# EAGLE design Optical Encoder (EAGLE 7.1.0)
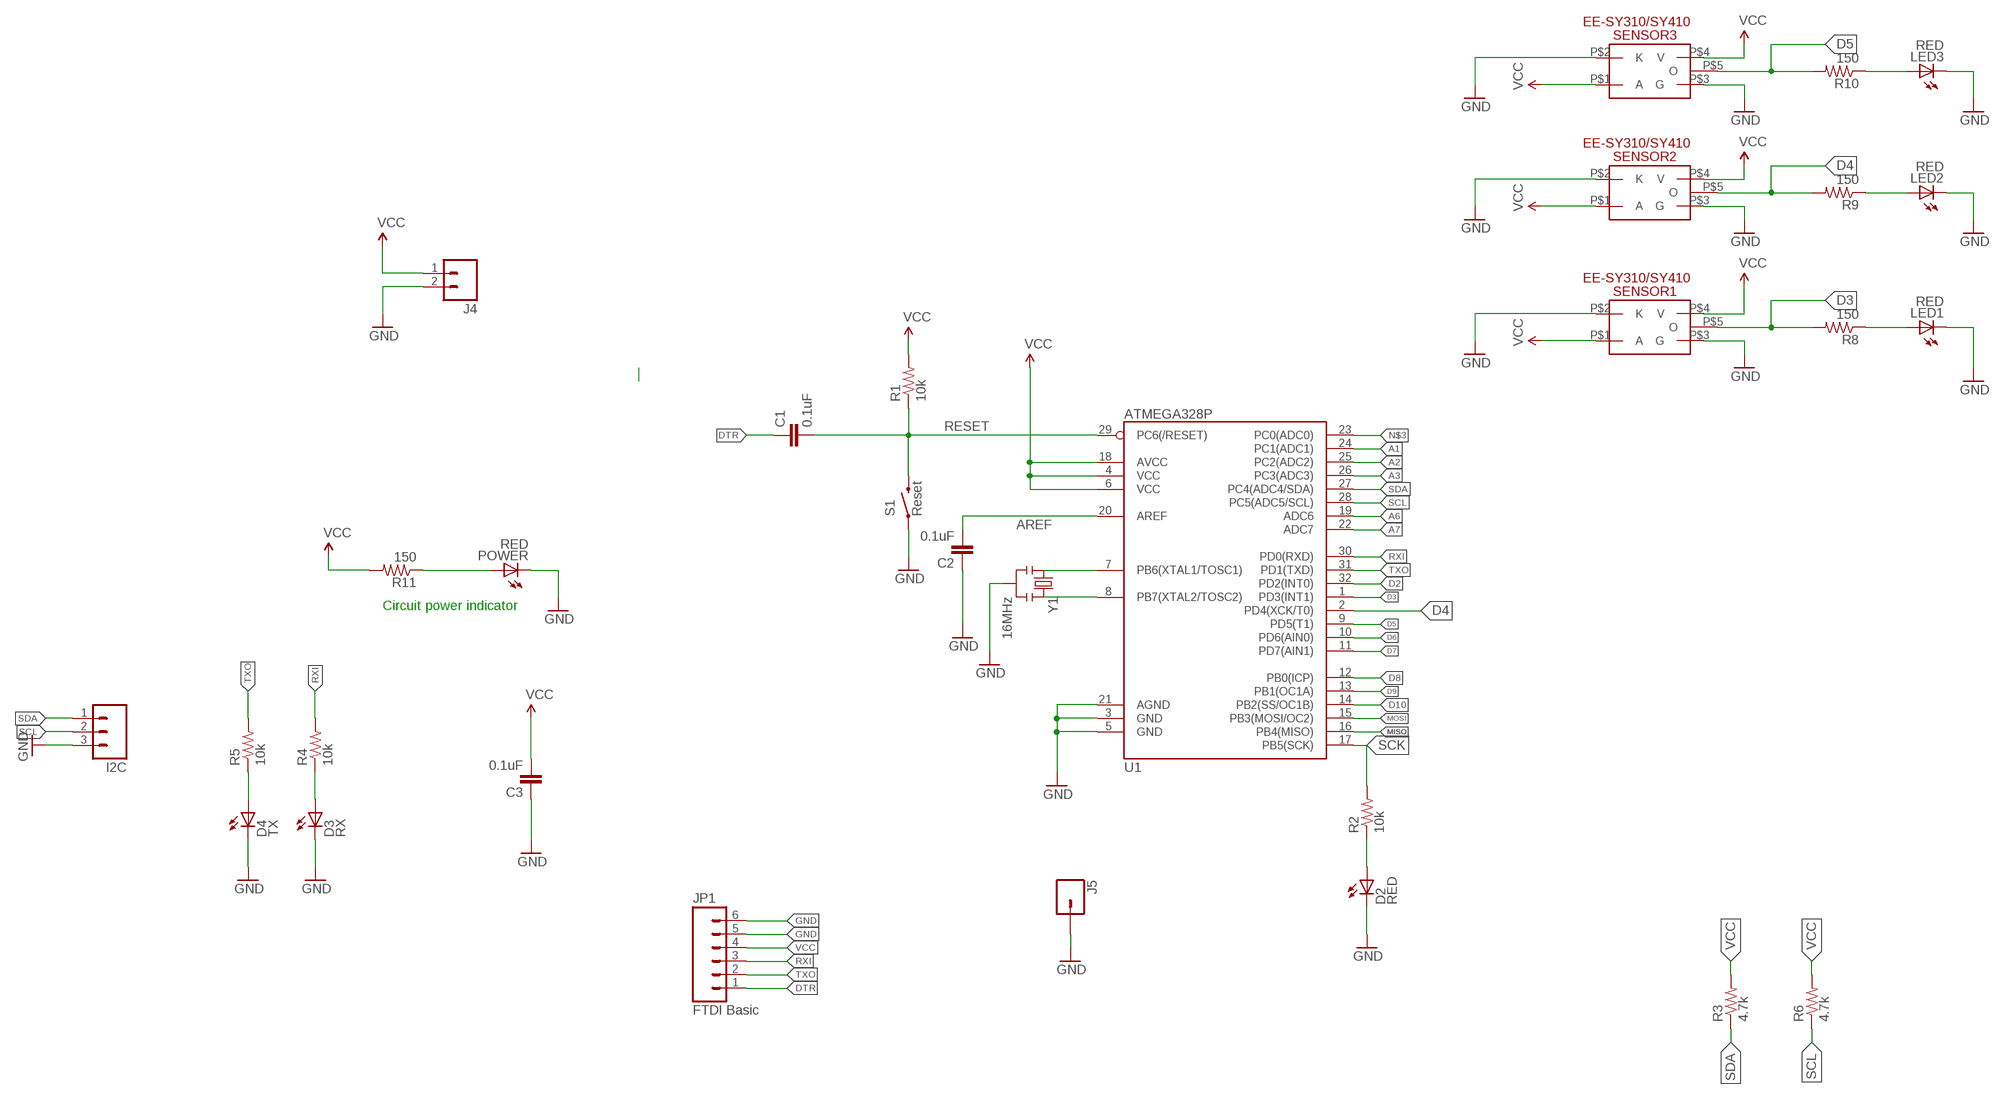
[diagram p0: schematic, sheet 1]

## Parts
C1  0.1uF  CAP0603-CAP  [0603-CAP]
C2  0.1uF  CAP0603-CAP  [0603-CAP]
C3  0.1uF  CAP0603-CAP  [0603-CAP]
D2  RED  LED-RED0603  [LED-0603]
D3  RX  LED-GREEN0603  [LED-0603]
D4  TX  LED-RED0603  [LED-0603]
I2C  M03PTH  [1X03]
J4  M02PTH  [1X02]
J5  M01PTH  [1X01]
JP1  FTDI Basic  M06POLAR  [MOLEX-1X6]
LED1  RED  LED-RED0603  [LED-0603]
LED2  RED  LED-RED0603  [LED-0603]
LED3  RED  LED-RED0603  [LED-0603]
POWER  RED  LED-RED0603  [LED-0603]
R1  10k  RESISTOR0603-RES  [0603-RES]
R2  10k  RESISTOR0603-RES  [0603-RES]
R3  4.7k  RESISTOR0603-RES  [0603-RES]
R4  10k  RESISTOR0603-RES  [0603-RES]
R5  10k  RESISTOR0603-RES  [0603-RES]
R6  4.7k  RESISTOR0603-RES  [0603-RES]
R8  150  RESISTOR0603-RES  [0603-RES]
R9  150  RESISTOR0603-RES  [0603-RES]
R10  150  RESISTOR0603-RES  [0603-RES]
R11  150  RESISTOR0603-RES  [0603-RES]
S1  Reset  SWITCH-MOMENTARY-2SMD  [TACTILE_SWITCH_SMD]
SENSOR1  EE-SY310/SY410  [EE-SY310/SY410]
SENSOR2  EE-SY310/SY410  [EE-SY310/SY410]
SENSOR3  EE-SY310/SY410  [EE-SY310/SY410]
U1  ATMEGA328P  ATMEGA328_SMT  [TQFP32-08]
Y1  16MHz  RESONATOR16MHZ  [RESONATOR-SMD]

## Nets
A1: U1.24(PC1(ADC1))
A2: U1.25(PC2(ADC2))
A3: U1.26(PC3(ADC3))
A6: U1.19(ADC6)
A7: U1.22(ADC7)
AREF: C2.2 U1.20(AREF)
D2: U1.32(PD2(INT0))
D3: R8.2 SENSOR1.P$5(O) U1.1(PD3(INT1))
D4: R9.2 SENSOR2.P$5(O) U1.2(PD4(XCK/T0))
D5: R10.2 SENSOR3.P$5(O) U1.9(PD5(T1))
D6: U1.10(PD6(AIN0))
D7: U1.11(PD7(AIN1))
D8: U1.12(PB0(ICP))
D9: U1.13(PB1(OC1A))
D10: U1.14(PB2(SS/OC1B))
DTR: C1.1 JP1.1
GND: C2.1 C3.1 D2.C D3.C D4.C I2C.3 J4.2 J5.1 JP1.5 JP1.6 LED1.C LED2.C LED3.C POWER.C S1.1 SENSOR1.P$2(K) SENSOR1.P$3(G) SENSOR2.P$2(K) SENSOR2.P$3(G) SENSOR3.P$2(K) SENSOR3.P$3(G) U1.3(GND) U1.5(GND) U1.21(AGND) Y1.2
MISO: U1.16(PB4(MISO))
MOSI: U1.15(PB3(MOSI/OC2))
N$1: U1.7(PB6(XTAL1/TOSC1)) Y1.1
N$2: U1.8(PB7(XTAL2/TOSC2)) Y1.3
N$3: U1.23(PC0(ADC0))
N$4: D2.A R2.1
N$5: D3.A R4.1
N$6: D4.A R5.1
N$7: LED1.A R8.1
N$9: POWER.A R11.1
N$19: LED3.A R10.1
N$20: LED2.A R9.1
RESET: C1.2 R1.1 S1.3 U1.29(PC6(/RESET))
RXI: JP1.3 R4.2 U1.30(PD0(RXD))
SCK: R2.2 U1.17(PB5(SCK))
SCL: I2C.2 R6.1 U1.28(PC5(ADC5/SCL))
SDA: I2C.1 R3.1 U1.27(PC4(ADC4/SDA))
TXO: JP1.2 R5.2 U1.31(PD1(TXD))
VCC: C3.2 J4.1 JP1.4 R1.2 R3.2 R6.2 R11.2 SENSOR1.P$1(A) SENSOR1.P$4(V) SENSOR2.P$1(A) SENSOR2.P$4(V) SENSOR3.P$1(A) SENSOR3.P$4(V) U1.4(VCC) U1.6(VCC) U1.18(AVCC)

## Notes on the sheet
- Circuit power indicator

## Library data of the parts
C1-C3 = SparkFun-Passives:CAP: Capacitor Standard 0603 ceramic capacitor, and 0.1" leaded capacitor.
D2 LED1-LED3 POWER = SparkFun-LED:LED-RED: Assorted Red LEDs LilyPad 1206- DIO-09912 1206- DIO-00809 0603- DIO-00819; PROD_ID: DIO-00819
D3 = SparkFun-LED:LED-GREEN: Various green LEDs Green LEDs used in SFE Production 0603- DIO-00821 LARGE- DIO-00862 LILYPAD- DIO-09910; PROD_ID: DIO-00821; VALUE: GREEN
D4 = SparkFun-LED:LED-RED: Assorted Red LEDs LilyPad 1206- DIO-09912 1206- DIO-00809 0603- DIO-00819; PROD_ID: DIO-00819; VALUE: RED
I2C = SparkFun-Connectors:M03: Header 3 Standard 3-pin 0.1" header. Use with straight break away headers (SKU : PRT-00116), right angle break away headers (PRT-00553), swiss pins (PRT-00743), machine pins (PRT-00117), and female headers (PRT-00115). Molex polarized connector foot print use with SKU : PRT-08232 with associated crimp pins and housings.
J4 = SparkFun-Connectors:M02: Standard 2-pin 0.1" header. Use with - straight break away headers ( PRT-00116) - right angle break away headers (PRT-00553) - swiss pins (PRT-00743) - machine pins (PRT-00117) - female headers (PRT-00115) Molex polarized connector foot print use with: PRT-08233 with associated crimp pins and housings. 2.54_SCREWTERM for use with PRT-10571. 3.5mm Screw Terminal footprints for PRT-08084 5mm Screw Terminal footprints for use with PRT-08432
J5 = SparkFun-Connectors:M01: Header 1 Standard 1-pin 0.1" header. Use with straight break away headers (SKU : PRT-00116), right angle break away headers (PRT-00553), swiss pins (PRT-00743), machine pins (PRT-00117), and female headers (PRT-00115). SMTSO-256-ET is a "flush mount" nut for a 4-40 screw. The older package used to be too tight, and did not allow it to sit properly thru the drill hit. The latest (0.165DIA) fits nice and snug.
JP1 = SparkFun-Connectors:M06: Header 6 Standard 6-pin 0.1" header. Use with straight break away headers (SKU : PRT-00116), right angle break away headers (PRT-00553), swiss pins (PRT-00743), machine pins (PRT-00117), and female headers (PRT-00115). Molex polarized connector foot print use with SKU : PRT-08094 with associated crimp pins and housings. NOTES ON THE VARIANTS LOCK and LOCK_LONGPADS... This footprint was designed to help hold the alignment of a through-hole component (i.e. 6-pin header) while soldering it into place. You may notice that each hole has been shifted either up or down by 0.005 of an inch from it's more standard position (which is a perfectly straight line). This slight alteration caused the pins (the squares in the middle) to touch the edges of the holes. Because they are alternating, it causes a "brace" to hold the component in place. 0.005 has proven to be the perfect amount of "off-center" position when using our standard breakaway headers. Although looks a little odd when you look at the bare footprint, once you have a header in there, the alteration is very hard to notice. Also,if you push a header all the way into place, it is covered up entirely on the bottom side. This idea of altering the position of holes to aid alignment will be further integrated into the Sparkfun Library for other footprints. It can help hold any component with 3 or more connection pins.
R1-R6 R8-R11 = SparkFun-Passives:RESISTOR: Resistor Basic schematic elements and footprints for 0603, 1206, and PTH resistors.
S1 = SparkFun-Electromechanical:SWITCH-MOMENTARY-2: Various NO switches- pushbuttons, reed, etc; PROD_ID: SWCH-08247
SENSOR1-SENSOR3 = EE-SY310-SY410:EE-SY310/SY410
U1 = SparkFun-DigitalIC:ATMEGA328_SMT: 32-Pin Atmega328 part Commonly used on Arduino compatible boards Available in QFP and QFN packages TQFP is IC-09069 QFN is non-stock; PROD_ID: IC-09069
Y1 = SparkFun-FreqCtrl:RESONATOR: Resonator Small SMD resonator. Used, eg, on the Arduino Pro/ Pro Mini boards. 8MHz- XTAL-08895 16MHz- XTAL-08900; PROD_ID: XTAL-08900

## Board
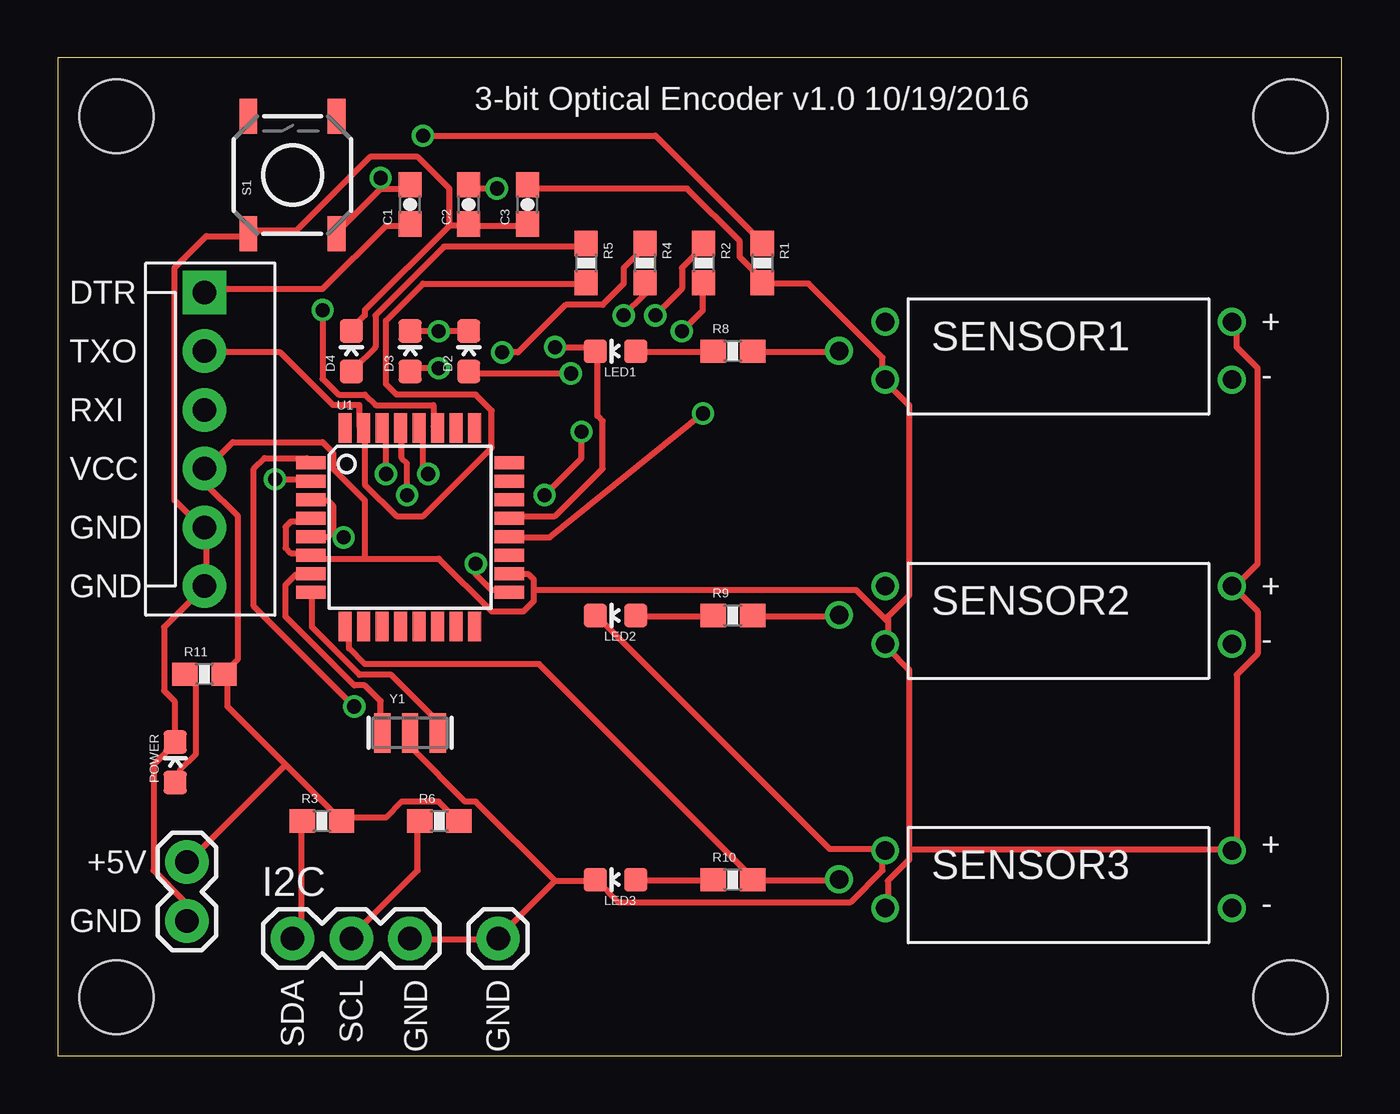
[diagram p1: board, top side]
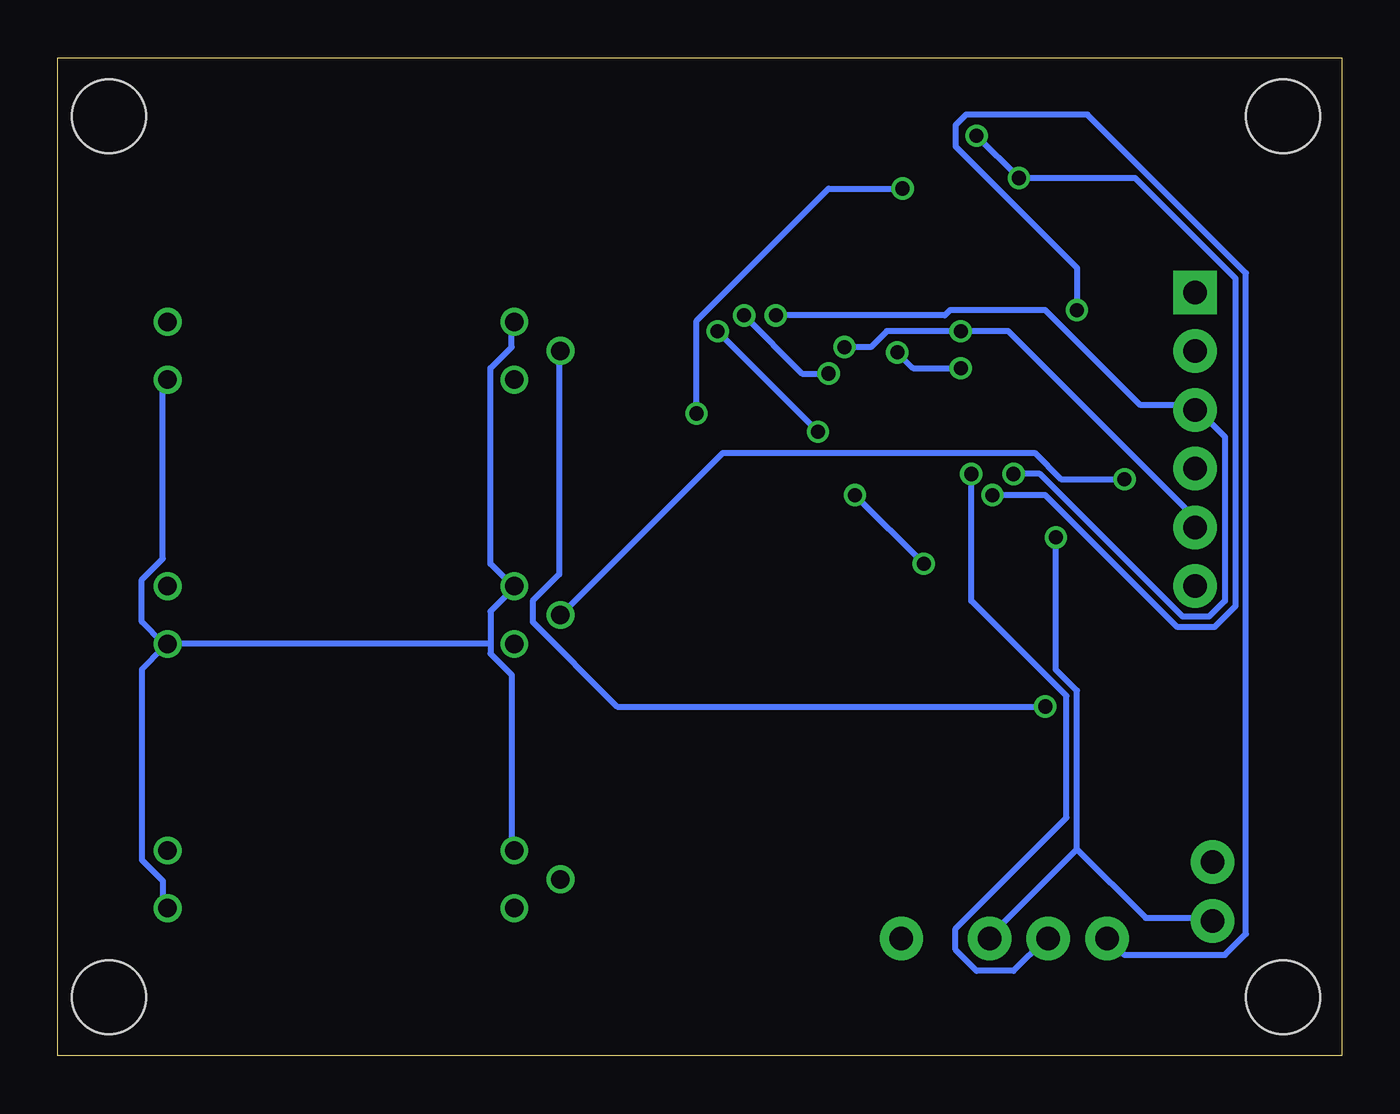
[diagram p2: board, bottom side, seen from below]

Size 55.55 x 43.17 mm. Coordinates in mm from the lower left corner, seen from the top.
Outline: 0,0 55.55,0 55.55,43.17 0,43.17 0,0
Copper layers (1*16): Top 0.0356mm / dielectric 1.5011mm / Bottom 0.0356mm
Design rules "LaenPCBOrder": minimum track width 6mil, minimum drill 13mil, track to track 6mil, track to pad 6mil, pad to pad 6mil, via to via 6mil, smd to smd 6mil, copper to edge 15mil, drill to drill 6mil, minimum pad ring 7mil, minimum via ring 7mil, stop-mask expansion 3mil, vias tented up to drill 0mil, thermal gap 10mil
Holes 3.2 mm at 2.54,40.64 53.34,40.64 2.54,2.54 53.34,2.54

### Footprints (pad centres in the part's own frame; a part is rotated, then mirrored left to right if it is on the bottom)
0603-CAP = smd 1.1 x 1: 1 -0.85,0; 2 0.85,0
LED-0603 = smd 1 x 1: A 0,-0.877; C 0,0.877
1X03 = drill 1.016 pad 1.88: 1 0,0; 2 2.54,0; 3 5.08,0
1X02 = drill 1.016 pad 1.88: 1 0,0; 2 2.54,0
1X01 = drill 1.016 pad 1.88: 1 0,0
MOLEX-1X6 = drill 1.016 pad 1.88 square: 1 0,0 | drill 1.016 pad 1.88: 2 2.54,0; 3 5.08,0; 4 7.62,0; 5 10.16,0; 6 12.7,0
0603-RES = smd 1.1 x 1: 1 -0.85,0; 2 0.85,0
TACTILE_SWITCH_SMD = smd 1.524 x 0.762: 1 -2.54,1.905; 2 2.54,1.905; 3 -2.54,-1.905; 4 2.54,-1.905
EE-SY310/SY410 = drill 0.8: P$1 0,0; P$2 0,-2.5; P$3 -15,0; P$4 -15,-2.5; P$5 -17,-1.25
TQFP32-08 = smd 1.27 x 0.559: 1 -4.293,2.8; 2 -4.293,2; 3 -4.293,1.2; 4 -4.293,0.4; 5 -4.293,-0.4; 6 -4.293,-1.2; 7 -4.293,-2; 8 -4.293,-2.8; 17 4.293,-2.8; 18 4.293,-2; 19 4.293,-1.2; 20 4.293,-0.4; 21 4.293,0.4; 22 4.293,1.2; 23 4.293,2; 24 4.293,2.8 | smd 0.559 x 1.27: 9 -2.8,-4.293; 10 -2,-4.293; 11 -1.2,-4.293; 12 -0.4,-4.293; 13 0.4,-4.293; 14 1.2,-4.293; 15 2,-4.293; 16 2.8,-4.293; 25 2.8,4.293; 26 2,4.293; 27 1.2,4.293; 28 0.4,4.293; 29 -0.4,4.293; 30 -1.2,4.293; 31 -2,4.293; 32 -2.8,4.293
RESONATOR-SMD = smd 0.7 x 1.7: 1 -1.2,0; 2 0,0; 3 1.2,0

### Placement (x,y rotation side)
C1  15.24,36.83 90 top
C2  17.78,36.83 90 top
C3  20.32,36.83 90 top
D2  17.78,30.48 0 top
D3  15.24,30.48 0 top
D4  12.7,30.48 0 top
I2C  10.16,5.08 0 top
J4  5.59,8.38 270 top
J5  19.05,5.08 0 top
JP1  6.35,33.02 270 top
LED1  24.13,30.48 90 top
LED2  24.13,19.05 90 top
LED3  24.13,7.62 90 top
POWER  5.08,12.7 0 top
R1  30.48,34.29 270 top
R2  27.94,34.29 270 top
R3  11.43,10.16 0 top
R4  25.4,34.29 270 top
R5  22.86,34.29 270 top
R6  16.51,10.16 0 top
R8  29.21,30.48 0 top
R9  29.21,19.05 0 top
R10  29.21,7.62 0 top
R11  6.35,16.51 0 top
S1  10.16,38.1 90 top
SENSOR1  50.8,31.75 0 top
SENSOR2  50.8,20.32 0 top
SENSOR3  50.8,8.89 0 top
U1  15.24,22.86 0 top
Y1  15.24,13.97 0 top

### Tracks (layer width: path | path; a pad name or v marks a point on that pad's centre or on a via)
AREF  (via drill 0.61)
  Top 0.254: v19,37.52 17.86,37.52 C2.2 | v27.91,27.79 21.29,22.43 19.68,22.43 U1.20
  Bottom 0.254: v19,37.52 22.2,37.52 27.91,31.8 v27.91,27.79
D3  (via drill 0.61)
  Top 0.254: R8.2 30.2,30.43 33.63,30.43 SENSOR1.P$5 | v12.83,15.11 8.48,19.46 8.48,25.4 8.94,25.86 10.77,25.86 U1.1
  Bottom 0.254: v12.83,15.11 31.34,15.11 35,18.77 35,19.68 33.86,20.83 33.86,30.43 SENSOR1.P$5
D4  (via drill 0.61)
  Top 0.254: R9.2 30.2,19 33.63,19 SENSOR2.P$5 | v9.4,24.94 10.77,24.94 U1.2
  Bottom 0.254: v9.4,24.94 12.14,24.94 13.28,26.09 26.77,26.09 33.63,19.23 SENSOR2.P$5
D5
  Top 0.254: SENSOR3.P$5 33.63,7.57 30.2,7.57 R10.2 29.97,7.8 20.83,16.94 13.28,16.94 12.6,17.63 12.6,18.54 U1.9
DTR
  Top 0.254: C1.1 15.11,35.92 14.2,35.92 11.45,33.17 6.43,33.17 JP1.1
GND  (via drill 0.61)
  Top 0.254: 21.51,7.57 23.11,7.57 LED3.C 23.34,7.57 24.26,6.66 34.31,6.66 35.69,8.03 35.69,8.71 SENSOR3.P$3 35.69,8.94 33.4,8.94 23.34,19 LED2.C | 21.51,7.57 19.23,5.28 J5.1 19,5.05 15.34,5.05 I2C.3 | 21.51,7.57 18.09,11 17.63,11 15.34,13.28 15.34,13.97 Y1.2 | 11.91,22.66 11.68,22.43 11,22.43 U1.5 | 11.91,22.66 11.91,23.8 11.68,24.03 11,24.03 U1.3 | 11.91,22.66 12.14,22.66 v12.37,22.43 | 16.94,35.92 13.28,32.26 13.28,32.03 12.83,31.57 D4.C | 16.94,35.92 17.63,35.92 C2.1 17.86,35.92 20.14,35.92 C3.1 | 16.94,35.92 16.94,37.52 15.57,38.89 13.51,38.89 10.31,35.69 8.25,35.69 S1.1 8.25,35.46 6.43,35.46 5.05,34.09 5.05,24.03 6.2,22.88 JP1.5 6.43,22.66 6.43,20.37 JP1.6 6.2,20.14 4.6,18.54 4.6,15.8 5.05,15.34 5.05,13.74 POWER.C 5.05,13.51 4.14,12.6 4.14,8.03 5.51,6.66 5.51,5.97 J4.2 | U1.21 19.68,23.34 21.51,23.34 23.57,25.4 23.57,27.46 23.34,27.69 23.34,30.43 LED1.C 23.11,30.66 v21.51,30.66 | D3.C 15.34,31.34 v16.48,31.34 17.63,31.34 D2.C
  Bottom 0.254: 36.83,17.86 36.83,19.23 35.92,20.14 SENSOR2.P$3 35.92,20.37 36.83,21.29 36.83,29.74 35.92,30.66 35.92,31.57 SENSOR1.P$3 | 36.83,17.86 36.83,17.4 35.92,16.48 35.92,8.94 SENSOR3.P$3 | SENSOR3.P$2 51,6.43 51,7.57 51.92,8.48 51.92,16.71 51,17.63 SENSOR2.P$2 | SENSOR1.P$2 51,29.06 51,21.51 51.92,20.6 51.92,18.77 51,17.86 SENSOR2.P$2 | 36.83,17.86 50.77,17.86 SENSOR2.P$2 | v12.37,22.43 12.37,16.71 11.45,15.8 11.45,8.94 | 11.45,8.94 15.11,5.28 I2C.3 | 11.45,8.94 8.48,5.97 5.74,5.97 J4.2 | JP1.5 6.43,22.88 6.43,23.34 14.43,31.34 v16.48,31.34 19.68,31.34 20.37,30.66 v21.51,30.66
N$1
  Top 0.254: U1.7 10.77,20.83 10.31,20.83 9.86,20.37 9.86,19 12.83,16.03 13.28,16.03 13.97,15.34 13.97,13.97 Y1.1
N$2
  Top 0.254: U1.8 11,19.91 11,18.54 13.06,16.48 14.43,16.48 16.26,14.66 16.26,13.97 Y1.3
N$4  (via drill 0.61)
  Top 0.254: v22.2,29.52 17.86,29.52 D2.A | v25.86,32.03 27,33.17 27,34.09 27.91,35 R2.1
  Bottom 0.254: v22.2,29.52 23.34,29.52 v25.86,32.03
N$5  (via drill 0.61)
  Top 0.254: v16.48,29.74 15.34,29.74 D3.A | v19.23,30.43 19.91,30.43 21.97,32.49 23.57,32.49 24.49,33.4 24.49,34.09 25.4,35 R4.1
  Bottom 0.254: v16.48,29.74 18.54,29.74 v19.23,30.43
N$6
  Top 0.254: D4.A 12.83,29.74 13.74,30.66 13.74,32.03 16.71,35 22.66,35 R5.1
N$7
  Top 0.254: LED1.A 25.17,30.43 28.14,30.43 R8.1
N$9
  Top 0.254: POWER.A 5.28,11.91 5.28,12.37 5.97,13.06 5.97,16.03 5.51,16.48 R11.1
N$19
  Top 0.254: LED3.A 25.17,7.57 28.14,7.57 R10.1
N$20
  Top 0.254: LED2.A 25.17,19 28.14,19 R9.1
RESET  (via drill 0.61)
  Top 0.254: 13.97,37.52 15.11,37.52 C1.2 | 13.97,37.52 12.14,35.69 S1.3 | v15.8,39.8 25.86,39.8 30.43,35.23 R1.1 | 13.97,37.52 v13.97,37.97 | v15.11,24.26 15.11,25.63 14.88,25.86 14.88,27 U1.29
  Bottom 0.254: v15.8,39.8 v13.97,37.97 8.94,37.97 4.6,33.63 4.6,19.46 5.51,18.54 7.11,18.54 12.83,24.26 v15.11,24.26
RXI  (via drill 0.61)
  Top 0.254: R4.2 25.4,32.94 v24.49,32.03 | v14.2,25.17 14.2,27 U1.30
  Bottom 0.254: v24.49,32.03 17.17,32.03 16.94,32.26 12.83,32.26 8.71,28.14 6.43,28.14 JP1.3 6.2,27.91 5.05,26.77 5.05,19.68 5.74,19 6.88,19 13.06,25.17 v14.2,25.17
SCK  (via drill 0.61)
  Top 0.254: v27,31.34 27.91,32.26 27.91,33.4 R2.2 | v22.66,27 22.66,25.86 v21.06,24.26 | v18.09,21.29 18.09,20.83 18.77,20.14 19.46,20.14 U1.17
  Bottom 0.254: v22.66,27 v27,31.34 | v18.09,21.29 v21.06,24.26
SCL  (via drill 0.61)
  Top 0.254: R6.1 15.57,10.08 15.57,8.03 12.83,5.28 I2C.2 | v16.03,25.17 15.8,25.4 15.8,27 U1.28
  Bottom 0.254: v16.03,25.17 16.03,19.68 11.91,15.57 11.91,10.31 16.71,5.51 16.71,4.6 15.8,3.68 14.2,3.68 12.83,5.05 I2C.2
SDA  (via drill 0.61)
  Top 0.254: R3.1 10.54,10.08 10.54,5.51 10.31,5.28 I2C.1 | v11.45,32.26 11.45,29.29 12.14,28.6 13.28,28.6 13.74,28.14 16.26,28.14 16.26,27.23 U1.27
  Bottom 0.254: v11.45,32.26 11.45,34.09 16.71,39.34 16.71,40.26 16.26,40.72 11,40.72 4.14,33.86 4.14,5.28 5.05,4.37 9.4,4.37 10.08,5.05 I2C.1
TXO
  Top 0.254: R5.2 22.66,33.4 15.8,33.4 14.2,31.8 14.2,29.06 14.66,28.6 18.09,28.6 18.77,27.91 18.77,26.31 15.8,23.34 14.66,23.34 13.28,24.71 13.28,27 U1.31 13.06,27.23 13.06,28.14 11.91,28.14 9.63,30.43 6.43,30.43 JP1.2
VCC
  Top 0.254: U1.4 10.77,23.11 10.08,23.11 9.86,22.88 9.86,21.97 10.08,21.74 10.77,21.74 U1.6 11,21.51 13.28,21.51 | 20.6,20.14 20.6,19.68 20.14,19.23 18.77,19.23 16.48,21.51 13.28,21.51 | 20.6,20.14 20.6,20.6 20.37,20.83 19.68,20.83 U1.18 | R6.2 17.17,10.31 16.48,11 14.88,11 14.2,10.31 12.37,10.31 R3.2 12.14,10.31 9.86,12.6 | 9.86,12.6 7.34,15.11 7.34,16.48 R11.2 7.34,16.71 7.8,17.17 7.8,23.34 6.43,24.71 6.43,25.4 | 9.86,12.6 5.74,8.48 J4.1 | 13.28,21.51 13.28,24.03 11.91,25.4 11.91,26.09 11.45,26.54 7.57,26.54 6.43,25.4 | 6.43,25.4 JP1.4 | SENSOR1.P$1 51,31.57 51,30.66 51.92,29.74 51.92,21.29 51,20.37 SENSOR2.P$1 51,20.14 51.92,19.23 51.92,17.4 51,16.48 51,8.94 SENSOR3.P$1 50.77,8.94 36.83,8.94 | 36.83,8.94 36.83,16.71 35.92,17.63 SENSOR2.P$4 35.92,17.86 35.92,18.77 | 36.83,8.94 36.83,8.48 35.92,7.57 35.92,6.43 SENSOR3.P$4 | C3.2 20.37,37.52 27.23,37.52 29.52,35.23 29.52,34.54 30.43,33.63 R1.2 30.66,33.4 32.49,33.4 35.69,30.2 35.69,29.29 SENSOR1.P$4 35.92,29.06 36.83,28.14 36.83,19.91 35.92,19 35.92,18.77 | 20.6,20.14 34.54,20.14 35.92,18.77

### Text on the board
tPlace: 3-bit Optical Encoder v1.0 10/19/2016
_tsilk: DTR | + | TXO | - | RXI | VCC | GND | GND | + | - | + | +5V | - | GND | SDA | SCL | GND | GND